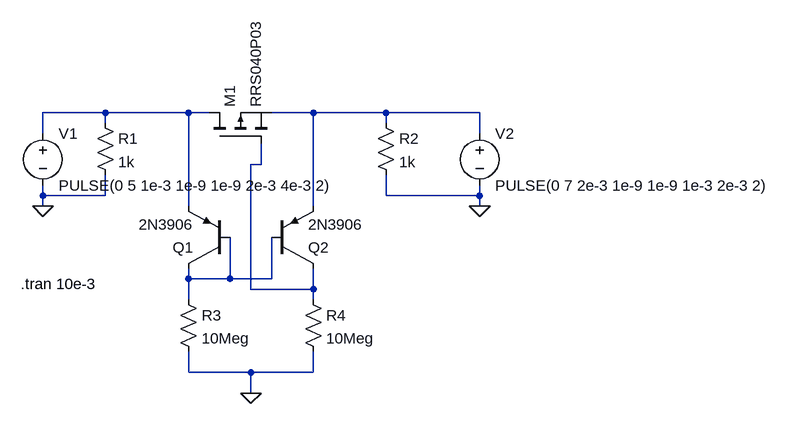
[diagram p0: schematic IdealDiodeDriver.asc]
IdealDiodeDriver.asc, the LTspice schematic file:
Version 4
SHEET 1 1052 680
WIRE 32 16 -64 16
WIRE 160 16 32 16
WIRE 192 16 160 16
WIRE 352 16 288 16
WIRE 464 16 352 16
WIRE 608 16 464 16
WIRE 32 32 32 16
WIRE 464 32 464 16
WIRE -64 48 -64 16
WIRE 608 48 608 16
WIRE 272 96 272 64
WIRE 272 96 256 96
WIRE -64 144 -64 128
WIRE 32 144 32 112
WIRE 32 144 -64 144
WIRE 464 144 464 112
WIRE 608 144 608 128
WIRE 608 144 464 144
WIRE -64 160 -64 144
WIRE 160 160 160 16
WIRE 352 160 352 16
WIRE 608 160 608 144
WIRE 160 272 160 256
WIRE 224 272 224 208
WIRE 224 272 160 272
WIRE 288 272 288 208
WIRE 288 272 224 272
WIRE 256 288 256 96
WIRE 352 288 352 256
WIRE 352 288 256 288
WIRE 160 304 160 272
WIRE 352 304 352 288
WIRE 160 416 160 384
WIRE 256 416 160 416
WIRE 352 416 352 384
WIRE 352 416 256 416
WIRE 256 448 256 416
FLAG -64 160 0
FLAG 608 160 0
FLAG 256 448 0
SYMBOL voltage -64 32 R0
WINDOW 123 0 0 Left 2
WINDOW 39 0 0 Left 2
SYMATTR InstName V1
SYMATTR Value PULSE(0 5 1e-3 1e-9 1e-9 2e-3 4e-3 2)
SYMBOL res 16 16 R0
SYMATTR InstName R1
SYMATTR Value 1k
SYMBOL res 448 16 R0
SYMATTR InstName R2
SYMATTR Value 1k
SYMBOL voltage 608 32 R0
WINDOW 123 0 0 Left 2
WINDOW 39 0 0 Left 2
SYMATTR InstName V2
SYMATTR Value PULSE(0 7 2e-3 1e-9 1e-9 1e-3 2e-3 2)
SYMBOL pnp 224 256 R180
SYMATTR InstName Q1
SYMATTR Value 2N3906
SYMBOL pnp 288 256 M180
SYMATTR InstName Q2
SYMATTR Value 2N3906
SYMBOL res 144 288 R0
SYMATTR InstName R3
SYMATTR Value 10Meg
SYMBOL res 336 288 R0
SYMATTR InstName R4
SYMATTR Value 10Meg
SYMBOL pmos 192 64 R270
SYMATTR InstName M1
SYMATTR Value RRS040P03
TEXT -98 280 Left 2 !.tran 10e-3

The netlist it stands for:
* IdealDiodeDriver.asc
V1 N001 0 PULSE(0 5 1e-3 1e-9 1e-9 2e-3 4e-3 2)
R1 N001 0 1k
R2 N002 0 1k
V2 N002 0 PULSE(0 7 2e-3 1e-9 1e-9 1e-3 2e-3 2)
Q1 N004 N004 N001 0 2N3906
Q2 N003 N004 N002 0 2N3906
R3 N004 0 10Meg
R4 N003 0 10Meg
M1 N001 N003 N002 N002 RRS040P03
.model NPN NPN
.model PNP PNP
.lib standard.bjt
.model NMOS NMOS
.model PMOS PMOS
.lib standard.mos
.tran 10e-3
.backanno
.end